# Altium schematic sheet MainBoard.SchDoc
size A3; SheetNumber: 1; SheetTotal: 1
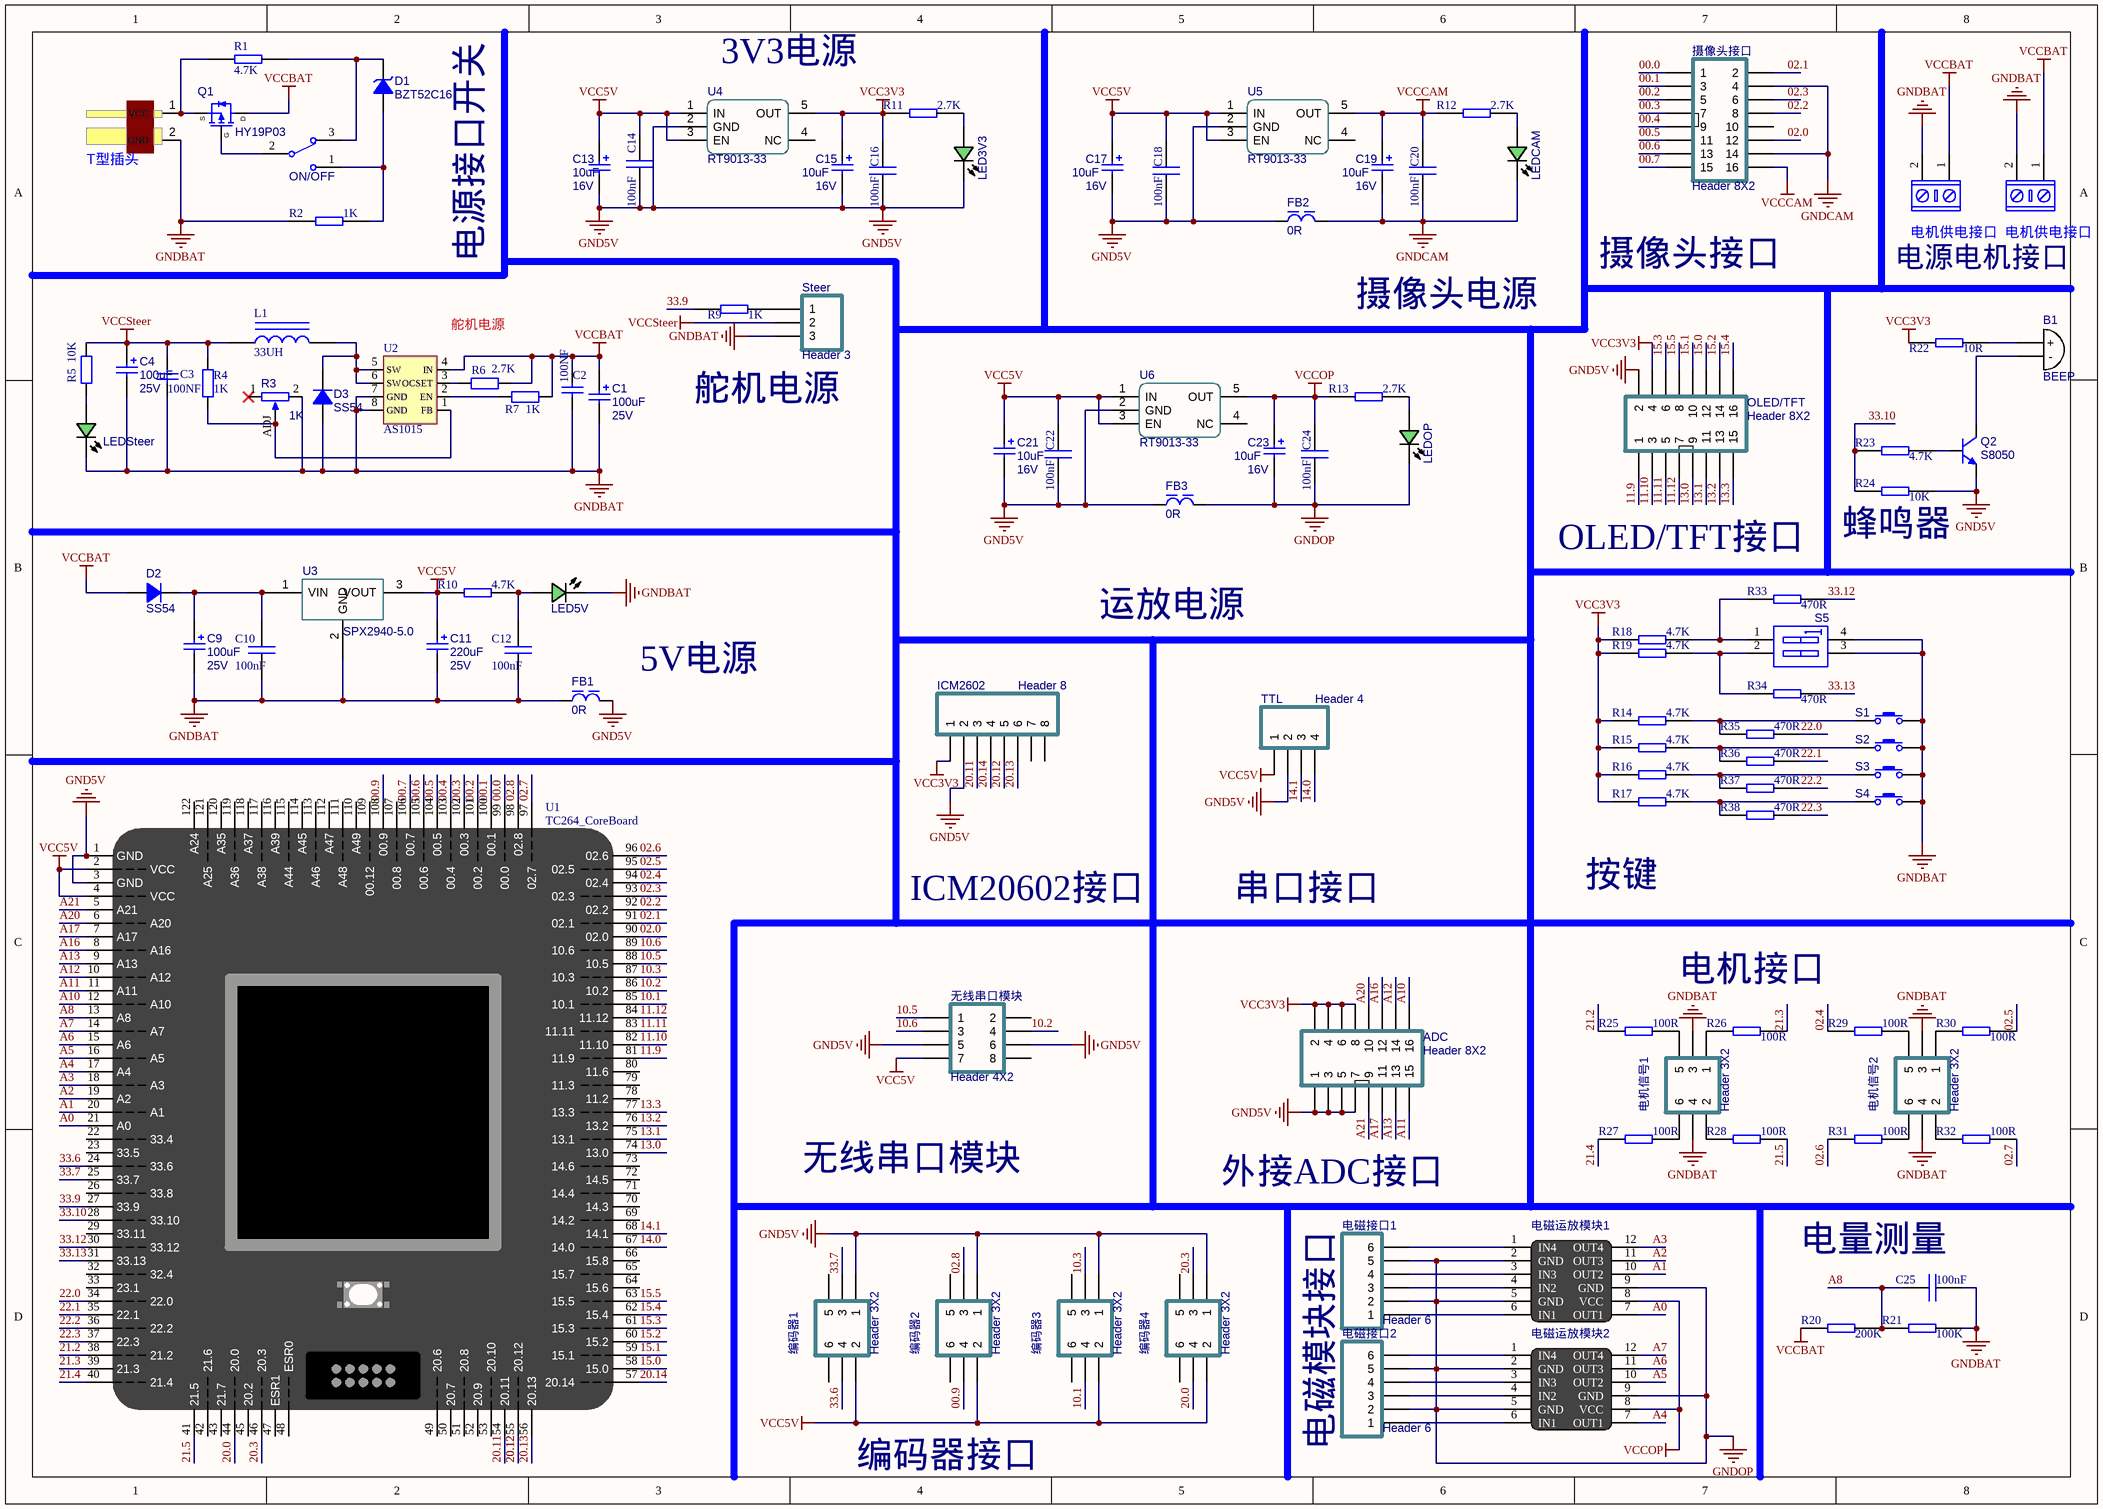
[diagram p0: MainBoard.SchDoc]

## Parts
ADC  Header 8X2  [HDR2X8]
B1  BEEP  [BEEP 9x5.5mm]
C1  value 100uF  Voltage: 25V  [CAPS6.3]  (hidden comment: 100uF 25V)
C2  100NF  [CAPC1608[0603]S-N]
C3  100NF  [CAPC1608[0603]S-N]
C4  value 100uF  Voltage: 25V  [CAPS6.3]  (hidden comment: 100uF 25V)
C9  value 100uF  Voltage: 25V  [CAPS6.3]  (hidden comment: 100uF 25V)
C10  100nF  [CAPC1608[0603]S-N]
C11  value 220uF  Voltage: 25V  [CAPS6.3]  (hidden comment: 220uF 25V)
C12  100nF  [CAPC1608[0603]S-N]
C13  value 10uF  Voltage: 16V  [CAPT3216]  (hidden comment: 10uF 16V)
C14  100nF  [CAPC1608[0603]S-N]
C15  value 10uF  Voltage: 16V  [CAPT3216]  (hidden comment: 10uF 16V)
C16  100nF  [CAPC1608[0603]S-N]
C17  value 10uF  Voltage: 16V  [CAPT3216]  (hidden comment: 10uF 16V)
C18  100nF  [CAPC1608[0603]S-N]
C19  value 10uF  Voltage: 16V  [CAPT3216]  (hidden comment: 10uF 16V)
C20  100nF  [CAPC1608[0603]S-N]
C21  value 10uF  Voltage: 16V  [CAPT3216]  (hidden comment: 10uF 16V)
C22  100nF  [CAPC1608[0603]S-N]
C23  value 10uF  Voltage: 16V  [CAPT3216]  (hidden comment: 10uF 16V)
C24  100nF  [CAPC1608[0603]S-N]
C25  100nF  [CAPC1608[0603]S-N]
D1  BZT52C16  [SOD-123-L]
D2  SS54  [SMA[DO-214AC]]
D3  SS54  [SMA[DO-214AC]]
DCIN  T型插头  [Wired T-Header ThroughHole]
DCOUT1  电机供电接口  [KF/WJ/DG 301-2p-5.0mm]
DCOUT?2  电机供电接口  [KF/WJ/DG 301-2p-5.0mm]
FB1  0R  [INDC2012[0805]S]
FB2  0R  [INDC2012[0805]S]
FB3  0R  [INDC2012[0805]S]
ICM2602  Header 8  [HDR1X8]
L1  33UH  [0630 TPC 7*7*3]
LED3V3  GREEN  [LEDC1608(0603)]  (value not drawn)
LED5V  GREEN  [LEDC1608(0603)]  (value not drawn)
LEDCAM  GREEN  [LEDC1608(0603)]  (value not drawn)
LEDOP  GREEN  [LEDC1608(0603)]  (value not drawn)
LEDSteer  GREEN  [LEDC1608(0603)]  (value not drawn)
OLED/TFT  Header 8X2  [HDR2X8]
ON/OFF  SW-SPDT  [SS12D10]  (value not drawn)
Q1  HY19P03  [TO-252AA]
Q2  S8050  [SOT-23]
R1  4.7K  [RESC1608[0603]S-N]
R2  1K  [RESC1608[0603]S-N]
R3  1K  [RESPOT3296]
R4  1K  [RESC1608[0603]S-N]
R5  10K  [RESC1608[0603]S-N]
R6  2.7K  [RESC1608[0603]S-N]
R7  1K  [RESC1608[0603]S-N]
R9  1K  [RESC1608[0603]S-N]
R10  4.7K  [RESC1608[0603]S-N]
R11  2.7K  [RESC1608[0603]S-N]
R12  2.7K  [RESC1608[0603]S-N]
R13  2.7K  [RESC1608[0603]S-N]
R14  4.7K  [RESC1608[0603]S-N]
R15  4.7K  [RESC1608[0603]S-N]
R16  4.7K  [RESC1608[0603]S-N]
R17  4.7K  [RESC1608[0603]S-N]
R18  4.7K  [RESC1608[0603]S-N]
R19  4.7K  [RESC1608[0603]S-N]
R20  200K  [RESC1608[0603]S-N]
R21  100K  [RESC1608[0603]S-N]
R22  10R  [RESC1608[0603]S-N]
R23  4.7K  [RESC1608[0603]S-N]
R24  10K  [RESC1608[0603]S-N]
R25  100R  [RESC1608[0603]S-N]
R26  100R  [RESC1608[0603]S-N]
R27  100R  [RESC1608[0603]S-N]
R28  100R  [RESC1608[0603]S-N]
R29  100R  [RESC1608[0603]S-N]
R30  100R  [RESC1608[0603]S-N]
R31  100R  [RESC1608[0603]S-N]
R32  100R  [RESC1608[0603]S-N]
R33  470R  [RESC1608[0603]S-N]
R34  470R  [RESC1608[0603]S-N]
R35  470R  [RESC1608[0603]S-N]
R36  470R  [RESC1608[0603]S-N]
R37  470R  [RESC1608[0603]S-N]
R38  470R  [RESC1608[0603]S-N]
S1  Button  [PTS810-3*4-CurvePin]  (value not drawn)
S2  Button  [PTS810-3*4-CurvePin]  (value not drawn)
S3  Button  [PTS810-3*4-CurvePin]  (value not drawn)
S4  Button  [PTS810-3*4-CurvePin]  (value not drawn)
S5  SW DIP-2  [DIP4]  (value not drawn)
Steer  Header 3  [HDR1X3]
TTL  Header 4  [HDR1X4]
U1  TC264_CoreBoard  [TC264_CoreBoard]
U2  AS1015  [SOP8]
U3  SPX2940-5.0  [TO-263-3]
U4  RT9013-33  [SOT-23-5]
U5  RT9013-33  [SOT-23-5]
U6  RT9013-33  [SOT-23-5]
摄像头接口  Header 8X2  [HDR2X8]
无线串口模块  Header 4X2  [HDR2X4]
电机信号1  Header 3X2  [HDR2X3]
电机信号2  Header 3X2  [HDR2X3-M-SMT]
电磁接口1  Header 6  [HDR1X6]
电磁接口2  Header 6  [HDR1X6]
电磁运放模块1  OPA_MOD  [SEEKFREE_4CHANEL_OPAMOD]  (value not drawn)
电磁运放模块2  OPA_MOD  [SEEKFREE_4CHANEL_OPAMOD]  (value not drawn)
编码器1  Header 3X2  [HDR2X3]
编码器2  Header 3X2  [HDR2X3]
编码器3  Header 3X2  [HDR2X3-M-SMT]
编码器4  Header 3X2  [HDR2X3-M-SMT]

## Nets
GND5V: ADC.1 ADC.3 ADC.5 ADC.7 C13.2 C14.1 C15.2 C16.1 C17.2 C18.1 C21.2 C22.1 FB1.2 FB2.1 FB3.1 ICM2602.2 LED3V3.C OLED/TFT.2 Q2.2(E) R24.2 TTL.2 U1.1(GND) U1.3(GND) U4.2(GND) U5.2(GND) U6.2(GND) 无线串口模块.5 无线串口模块.6 编码器1.1 编码器2.1 编码器3.1 编码器4.1
GNDBAT: C1.2 C2.1 C3.1 C4.2 C9.2 C10.1 C11.2 C12.1 C25.1 D3.A DCIN.2(GND) DCOUT1.2 DCOUT?2.2 FB1.1 LED5V.C LEDSteer.C R2.1 R3.2(BOT) R21.2 S1.1 S2.1 S3.1 S4.1 S5.3(B2) S5.4(B1) Steer.3 U2.7(GND) U2.8(GND) U3.2(GND) 电机信号1.3 电机信号1.4 电机信号2.3 电机信号2.4
GNDCAM: C19.2 C20.1 FB2.2 LEDCAM.C 摄像头接口.4 摄像头接口.14
GNDOP: C23.2 C24.1 FB3.2 LEDOP.C 电磁接口1.2 电磁接口1.5 电磁接口2.2 电磁接口2.5 电磁运放模块1.2(GND) 电磁运放模块1.5(GND) 电磁运放模块1.9(GND) 电磁运放模块2.2(GND) 电磁运放模块2.5(GND) 电磁运放模块2.9(GND)
VCC3V3: ADC.2 ADC.4 ADC.6 ADC.8 C15.1 C16.2 ICM2602.1 OLED/TFT.4 R11.1 R14.1 R15.1 R16.1 R17.1 R18.1 R19.1 R22.1 U4.5(OUT)
VCC5V: C11.1 C13.1 C14.2 C17.1 C18.2 C21.1 C22.2 R10.1 TTL.1 U1.2(VCC) U1.4(VCC) U3.3(VOUT) U4.1(IN) U4.3(EN) U5.1(IN) U5.3(EN) U6.1(IN) U6.3(EN) 无线串口模块.7 编码器1.2 编码器2.2 编码器3.2 编码器4.2
VCCBAT: C1.1 C2.2 D2.A DCOUT1.1 DCOUT?2.1 Q1.1(D) R6.1 R7.1 R20.1 U2.4(IN)
VCCCAM: C19.1 C20.2 R12.1 U5.5(OUT) 摄像头接口.16
VCCOP: C23.1 C24.2 R13.1 U6.5(OUT) 电磁运放模块1.8(VCC) 电磁运放模块2.8(VCC)
VCCSteer: C3.2 C4.1 L1.1 R4.2 R5.2 Steer.2
00.0: U1.99(00.0) 摄像头接口.1
00.1: U1.100(00.1) 摄像头接口.3
00.2: U1.101(00.2) 摄像头接口.5
00.3: U1.102(00.3) 摄像头接口.7
00.4: U1.103(00.4) 摄像头接口.9
00.5: U1.104(00.5) 摄像头接口.11
00.6: U1.105(00.6) 摄像头接口.13
00.7: U1.106(00.7) 摄像头接口.15
00.9: U1.108(00.9) 编码器2.4
02.0: U1.90(02.0) 摄像头接口.12
02.1: U1.91(02.1) 摄像头接口.2
02.2: U1.92(02.2) 摄像头接口.8
02.3: U1.93(02.3) 摄像头接口.6
02.4: R29.1 U1.94(02.4)
02.5: R30.2 U1.95(02.5)
02.6: R31.1 U1.96(02.6)
02.7: R32.2 U1.97(02.7)
02.8: U1.98(02.8) 编码器2.3
10.1: U1.85(10.1) 编码器3.4
10.2: U1.86(10.2) 无线串口模块.4
10.3: U1.87(10.3) 编码器3.3
10.5: U1.88(10.5) 无线串口模块.1
10.6: U1.89(10.6) 无线串口模块.3
11.9: OLED/TFT.1 U1.81(11.9)
11.10: OLED/TFT.3 U1.82(11.10)
11.11: OLED/TFT.5 U1.83(11.11)
11.12: OLED/TFT.7 U1.84(11.12)
13.0: OLED/TFT.9 U1.74(13.0)
13.1: OLED/TFT.11 U1.75(13.1)
13.2: OLED/TFT.13 U1.76(13.2)
13.3: OLED/TFT.15 U1.77(13.3)
14.0: TTL.4 U1.67(14.0)
14.1: TTL.3 U1.68(14.1)
15.0: OLED/TFT.12 U1.58(15.0)
15.1: OLED/TFT.10 U1.59(15.1)
15.2: OLED/TFT.14 U1.60(15.2)
15.3: OLED/TFT.6 U1.61(15.3)
15.4: OLED/TFT.16 U1.62(15.4)
15.5: OLED/TFT.8 U1.63(15.5)
20.0: U1.44(20.0) 编码器4.4
20.3: U1.46(20.3) 编码器4.3
20.11: ICM2602.3 U1.54(20.11)
20.12: ICM2602.5 U1.55(20.12)
20.13: ICM2602.6 U1.56(20.13)
20.14: ICM2602.4 U1.57(20.14)
21.2: R25.1 U1.38(21.2)
21.3: R26.2 U1.39(21.3)
21.4: R27.1 U1.40(21.4)
21.5: R28.2 U1.41(21.5)
22.0: R35.2 U1.34(22.0)
22.1: R36.2 U1.35(22.1)
22.2: R37.2 U1.36(22.2)
22.3: R38.2 U1.37(22.3)
33.6: U1.24(33.6) 编码器1.4
33.7: U1.25(33.7) 编码器1.3
33.9: R9.1 U1.27(33.9)
33.10: R23.1 R24.1 U1.28(33.10)
33.12: R33.2 U1.30(33.12)
33.13: R34.2 U1.31(33.13)
A0: U1.21(A0) 电磁运放模块1.7(OUT1)
A1: U1.20(A1) 电磁运放模块1.10(OUT2)
A2: U1.19(A2) 电磁运放模块1.11(OUT3)
A3: U1.18(A3) 电磁运放模块1.12(OUT4)
A4: U1.17(A4) 电磁运放模块2.7(OUT1)
A5: U1.16(A5) 电磁运放模块2.10(OUT2)
A6: U1.15(A6) 电磁运放模块2.11(OUT3)
A7: U1.14(A7) 电磁运放模块2.12(OUT4)
A8: C25.2 R20.2 R21.1 U1.13(A8)
A10: ADC.16 U1.12(A10)
A11: ADC.15 U1.11(A11)
A12: ADC.14 U1.10(A12)
A13: ADC.13 U1.9(A13)
A16: ADC.12 U1.8(A16)
A17: ADC.11 U1.7(A17)
A20: ADC.10 U1.6(A20)
A21: ADC.9 U1.5(A21)
NetB1_1: B1.1(+) R22.2
NetB1_2: B1.2(-) Q2.3(C)
NetC9_1: C9.1 C10.2 D2.K U3.1(VIN)
NetC12_2: C12.2 LED5V.A R10.2
NetD1_A: D1.A ON/OFF.1 R2.2
NetD1_K: D1.K ON/OFF.3 R1.2
NetD3_K: D3.K L1.2 U2.5(SW) U2.6(SW)
NetDCIN_1: DCIN.1(VCC) Q1.3(S) R1.1
NetLED3V3_A: LED3V3.A R11.2
NetLEDCAM_A: LEDCAM.A R12.2
NetLEDOP_A: LEDOP.A R13.2
NetLEDSteer_A: LEDSteer.A R5.1
NetON/OFF_2: ON/OFF.2 Q1.2(G)
NetQ2_1: Q2.1(B) R23.2
NetR3_ADJ: R3.ADJ R4.1 U2.1(FB)
NetR6_2: R6.2 U2.3(OCSET)
NetR7_2: R7.2 U2.2(EN)
NetR9_2: R9.2 Steer.1
NetR14_2: R14.2 R35.1 S1.2
NetR15_2: R15.2 R36.1 S2.2
NetR16_2: R16.2 R37.1 S3.2
NetR17_2: R17.2 R38.1 S4.2
NetR18_2: R18.2 R33.1 S5.1(A1)
NetR19_2: R19.2 R34.1 S5.2(A2)
NetR25_2: R25.2 电机信号1.5
NetR26_1: R26.1 电机信号1.1
NetR27_2: R27.2 电机信号1.6
NetR28_1: R28.1 电机信号1.2
NetR29_2: R29.2 电机信号2.5
NetR30_1: R30.1 电机信号2.1
NetR31_2: R31.2 电机信号2.6
NetR32_1: R32.1 电机信号2.2
Net电磁接口1_1: 电磁接口1.1 电磁运放模块1.6(IN1)
Net电磁接口1_3: 电磁接口1.3 电磁运放模块1.4(IN2)
Net电磁接口1_4: 电磁接口1.4 电磁运放模块1.3(IN3)
Net电磁接口1_6: 电磁接口1.6 电磁运放模块1.1(IN4)
Net电磁接口2_1: 电磁接口2.1 电磁运放模块2.6(IN1)
Net电磁接口2_3: 电磁接口2.3 电磁运放模块2.4(IN2)
Net电磁接口2_4: 电磁接口2.4 电磁运放模块2.3(IN3)
Net电磁接口2_6: 电磁接口2.6 电磁运放模块2.1(IN4)

Not connected (* = marked no-connect by the designer): ICM2602 7 8; R3 1(TOP)*; U1 22(33.4) 23(33.5) 26(33.8) 29(33.11) 32(32.4) 33(23.1) 42(21.6) 43(21.7) 45(20.2) 47(ESR1) 48(ESR0) 49(20.6) 50(20.7) 51(20.8) 52(20.9) 53(20.10) 64(15.6) 65(15.7) 66(15.8) 69(14.2) 70(14.3) 71(14.4) 72(14.5) 73(14.6) 78(11.2) 79(11.3) 80(11.6) 107(00.8) 109(00.12) 110(A49) 111(A48) 112(A47) 113(A46) 114(A45) 115(A44) 116(A39) 117(A38) 118(A37) 119(A36) 120(A35) 121(A25) 122(A24); U4 4(NC); U5 4(NC); U6 4(NC); 摄像头接口 10; 无线串口模块 2 8; 编码器1 5 6; 编码器2 5 6; 编码器3 5 6; 编码器4 5 6

## Notes on the sheet
- (near U4) 3V3电源
- 电源接口开关
- 摄像头电源
- 摄像头接口
- 电源电机接口
- 舵机电源
- OLED/TFT接口
- (near R24) 蜂鸣器
- 运放电源
- (near FB1) 5V电源
- ICM20602接口
- 串口接口
- 按键
- 电机接口
- 无线串口模块
- 外接ADC接口
- 电量测量
- 电磁模块接口
- 编码器接口

## Library data of the parts
ADC OLED/TFT 摄像头接口 = Header 8X2: Header, 8-Pin, Dual row; LatestRevisionDate: 17-Jul-2002; LatestRevisionNote: Re-released for DXP Platform.; Publisher: Altium Limited; Price(RMB): 0.00
B1 = BEEP: 蜂鸣器
C1 C4 C9 C11 = Cap-Solid: Polarized Capacitor (Radial); Published: 8-Jun-2000; Revision: July-2002: Re-released for DXP Platform.; Publisher: Altium Limited; Price(RMB): 0.000
C2 C3 = 0805 1uF (105) 10% 50V: 贴片电容; ComponentLink1Description: 供应商链接; ComponentLink1URL: http://www.szlcsc.com/product/details_29074.html; Package: 0805; Supplier: LC; SuppliersPartNumber: C28323
C10 C12 C14 C16 C18 C20 C22 C24 C25 = CAP: 电容
C13 C15 C17 C19 C21 C23 = Cap-Tan: Tantalum Capacitor; Published: 8-Jun-2000; Revision: July-2002: Re-released for DXP Platform.; Publisher: Altium Limited; Price(RMB): 0.000
D1 = Diode TVS Uni-Dir: TRANSIENT VOLTAGE  SUPPRESSOR DIODE; Imax: 500mA; Published: 8-Jun-2000; Publisher: Altium Limited; Price(RMB): 0.000
D2 D3 = Diode: 普通二极管 Diode; Imax: 500mA; Published: 8-Jun-2000; Revision: July-2002: Re-released for DXP Platform.; Publisher: Altium Limited; Price(RMB): 0.000
DCIN = T_Header
DCOUT1 DCOUT?2 = KF/WJ/DG 30x: 接线端子 2Pin
FB1-FB3 = Ind Chip 2: Chip Inductor, Ferrite-Core, Silkscreen Border; Imax: 50mA; DCR: .1m; Published: 8-Jun-2000; Revision: July-2002: Re-released for DXP Platform.; Publisher: Altium Limited; Price(RMB): 0.000; Value: 0R
ICM2602 = Header 8: Header, 8-Pin; LatestRevisionDate: 17-Jul-2002; LatestRevisionNote: Re-released for DXP Platform.; Publisher: Altium Limited; Price(RMB): 0.00
L1 = 1206 10uH 10%: 贴片电感; ComponentLink1Description: 供应商链接; ComponentLink1URL: http://www.szlcsc.com/product/details_1403.html; Package: 1206; Supplier: LC; SuppliersPartNumber: C1051
LED3V3 LED5V LEDCAM LEDOP LEDSteer = LED Chip Green: Typical Chip LED; Published: 8-Jun-2000; Revision: July-2002: Re-released for DXP Platform.; Publisher: Altium Limited; Price(RMB): 0.00
ON/OFF = SW-SPDT: 单刀双掷开关 3脚船型、钮子、拨动开关 SPDT Subminiature Toggle Switch; Published: 24-Mar-1999; Publisher: Altium Limited; Price(RMB): 0.000
Q1 = HY19P03: HY19P03 P-Channel MOSFET
Q2 = NPN S8050: Discrete NPN Bipolar Transistor; Published: 8-Jun-2000; Revision: July-2002: Re-released for DXP Platform.; Publisher: Altium Limited; Price(RMB): 0.000; PartNumber: S8050
R1 R2 R9-R38 = RES: 电阻
R3 = Res Adj 3p: 可调电阻; Value: 1K
R4-R7 = 0805 1KΩ (1001) 1%: 贴片电阻; ComponentLink1Description: 供应商链接; ComponentLink1URL: http://www.szlcsc.com/product/details_18201.html; Package: 0805; Supplier: LC; SuppliersPartNumber: C17513
S1-S4 = KEY: 按键; Published: 24-Mar-1999; Publisher: Altium Limited; Price(RMB): 0.000
S5 = Code SW-2: 2位拨码开关; Published: 24-Mar-1999; Revision: July-2002: Re-released for DXP Platform.; Publisher: Altium Limited; Price(RMB): 0.000
Steer = Header 3: Header, 3-Pin; LatestRevisionDate: 17-Jul-2002; LatestRevisionNote: Re-released for DXP Platform.; Publisher: Altium Limited; Price(RMB): 0.00
TTL = Header 4: Header, 4-Pin; LatestRevisionDate: 17-Jul-2002; LatestRevisionNote: Re-released for DXP Platform.; Publisher: Altium Limited; Price(RMB): 0.00
U1 = TC264_CoreBoard: 逐飞科技TC264核心板
U3 = LM2940-5.0: 5V LDO TO-263-3
U4-U6 = RT9013-33: 3.3V 500mA SOT-23-5 LDO
无线串口模块 = Header 4X2: Header, 4-Pin, Dual row; LatestRevisionDate: 17-Jul-2002; LatestRevisionNote: Re-released for DXP Platform.; Publisher: Altium Limited; Price(RMB): 0.00
电机信号1 电机信号2 编码器1-编码器4 = Header 3X2: Header, 3-Pin, Dual row; LatestRevisionDate: 17-Jul-2002; LatestRevisionNote: Re-released for DXP Platform.; Publisher: Altium Limited; Price(RMB): 0.00
电磁接口1 电磁接口2 = Header 6: Header, 6-Pin; LatestRevisionDate: 17-Jul-2002; LatestRevisionNote: Re-released for DXP Platform.; Publisher: Altium Limited; Price(RMB): 0.00
电磁运放模块1 电磁运放模块2 = OPA_4CHANNEL_SEEKFREE: OPA module